# Altium schematic sheet LB-word-PSU-3V.SchDoc
size A
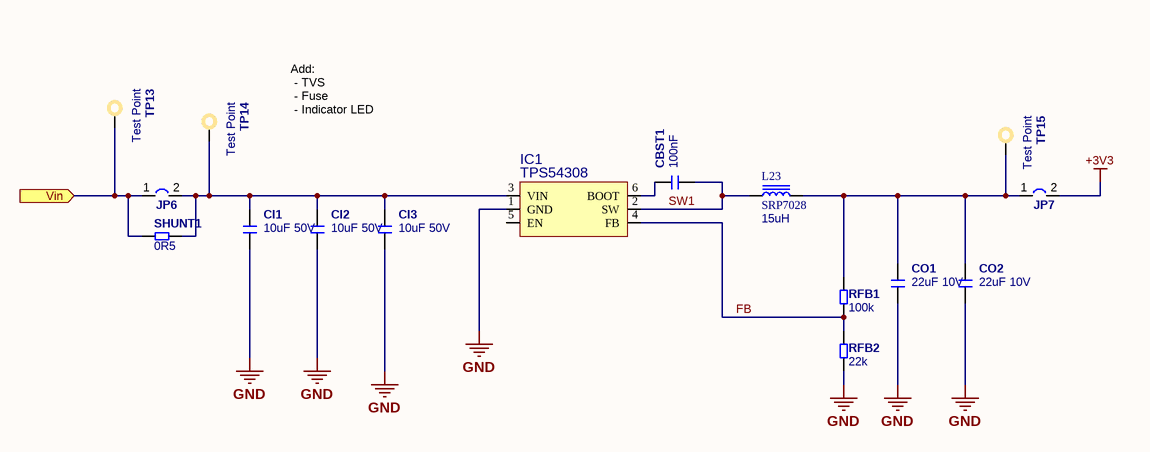
[diagram p0: LB-word-PSU-3V.SchDoc]

## Parts
CBST1  100nF  [C0603_N]
CI1  10uF 50V  [C1210_N]
CI2  10uF 50V  [C1210_N]
CI3  10uF 50V  [C1210_N]
CO1  22uF 10V  [C1210_N]
CO2  22uF 10V  [C1210_N]
IC1  TPS54308  [SOT23]
JP6  Jumper 2W  [Jumper SMD 2W NO]  (value not drawn)
JP7  Jumper 2W  [Jumper SMD 2W NO]  (value not drawn)
L23  SRP7028  value 15uH  [Inductor SRP7028]
RFB1  100k  [R0603]
RFB2  22k  [R0603]
SHUNT1  0R5  [R0603]
TP13  Test Point  [TestPoint-1.2mm]
TP14  Test Point  [TestPoint-1.2mm]
TP15  Test Point  [TestPoint-1.2mm]

## Ports
Vin (in)

## Nets
+3V3: JP7.2
GND: CI1.2 CI2.2 CI3.2 CO1.2 CO2.2 IC1.1(GND) RFB2.1
FB: IC1.4(FB) RFB1.1 RFB2.2
SW1: CBST1.2 IC1.2(SW) L23.1
Vin: JP6.1 SHUNT1.1 TP13.1 ; port Vin
NetCBST1_1: CBST1.1 IC1.6(BOOT)
NetCI1_1: CI1.1 CI2.1 CI3.1 IC1.3(VIN) JP6.2 SHUNT1.2 TP14.1
NetCO1_1: CO1.1 CO2.1 JP7.1 L23.2 RFB1.2 TP15.1

Not connected (* = marked no-connect by the designer): IC1 5(EN)

## Notes on the sheet
- Add:
  - TVS
  - Fuse
  - Indicator LED

## Library data of the parts
CBST1 CI1-CI3 CO1 CO2 = Capacitor: Capacitor MLCC; Manufacturer: Yageo; Manufacturer Part Number: CC0603KRX7R9BB104; Tolerance (%): 10; Category: Capacitor; Package: 0603; Supplier Part Number 1: 1362556; Supplier 1: Farnell; ComponentLink1URL: http://www.yageo.com; ComponentLink1Description: Manufacturer Website; Voltage Rating (Volts): *; Supplier 2: Digi-Key; Supplier Part Number 2: 311-1344-1-ND
  CBST1: Value: 100nF
  CI1-CI3: Value: 10uF 50V
  CO1 CO2: Value: 22uF 10V
IC1 = TPS54308: Buck Converter
L23 = Inductor
RFB1 RFB2 SHUNT1 = Resistor: Published: 17-Dec-2003; LatestRevisionDate: 19-Mar-2004; LatestRevisionNote: Silkscreen size reduced.; PackageDocument: Mar-2003; PackageReference: 3-0603; Publisher: Altium Limited; Code_IPC: 1608 [0603]; ComponentLink1Description: Manufacturer Link; ComponentLink1URL: http://www.panasonic.com/industrial/components/resistive_products.htm; ComponentLink2Description: Datasheet; ComponentLink2URL: http://www.panasonic.com/industrial/components/pdf/AOA0000CE2.pdf
  RFB1: Value: 100k
  RFB2: Value: 22k
  SHUNT1: Value: 0R5